# Altium project Dispenser.PrjPCB
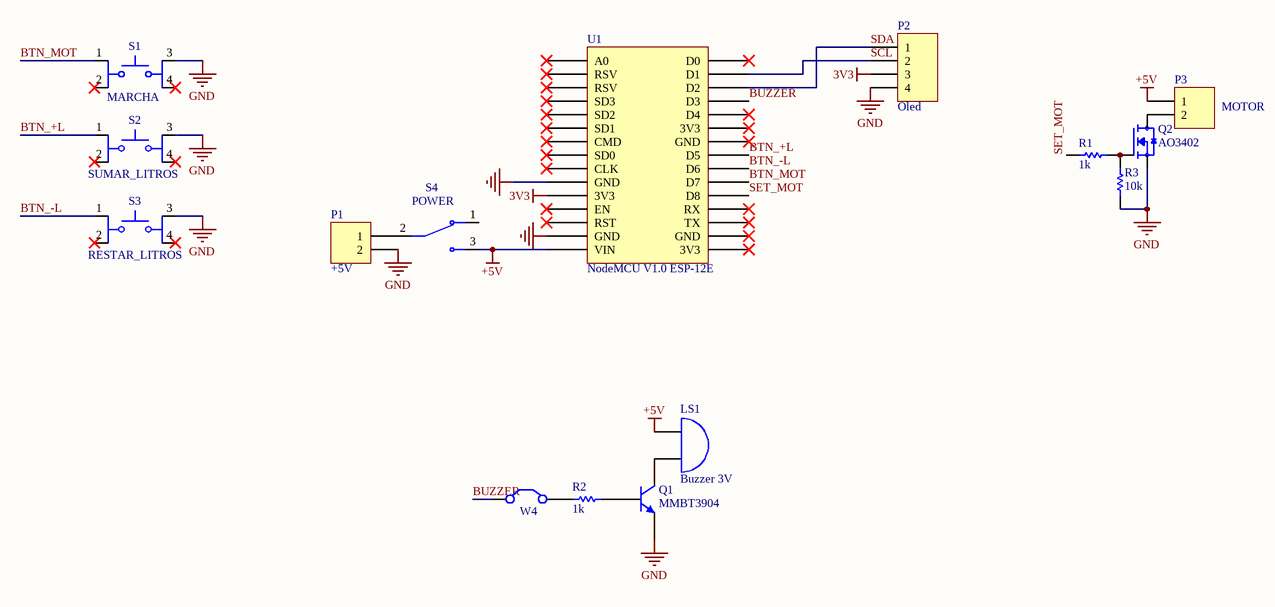
[diagram p0: Dispenser.SchDoc]
1 sheet, 15 parts. Net scope: global (net labels, ports and power ports of the same name join across sheets).
Board file: Dispenser.PcbDoc

## Sheet Dispenser.SchDoc
size A4; CheckedBy: M.Mainenti; DrawnBy: J.M.Navarro; DocumentNumber: 1; Revision: 1.1; SheetNumber: 1; SheetTotal: 1; DrawnDate: 30/05/2023; CheckedDdate: 30/05/2023

### Parts
LS1  Buzzer 3V  [BUZZER]
P1  +5V  [CON1X2]
P2  Oled  [HDR1X4]
P3  MOTOR  [CON1X2]
Q1  MMBT3904  [SOT23_N]
Q2  AO3402  [SOT95P280X125-3N]
R1  1k  [RESC2012N]
R2  1k  [RESC2012N]
R3  10k  [RESC2012N]
S1  MARCHA  [SW_TL3301FF160QG]
S2  SUMAR_LITROS  [SW_TL3301FF160QG]
S3  RESTAR_LITROS  [SW_TL3301FF160QG]
S4  POWER  [SW_MINI-SPDT-SW]
U1  NodeMCU V1.0 ESP-12E  [NodeMCU V1.0 ESP-12E]
W4  Jumper  [RESC1608N]  (value not drawn)

### Nets
3V3: P2.3 U1.3V3
+5V: LS1.1(A) P3.1 S4.3 U1.VIN
GND: P1.2 P2.4 Q1.2(E) Q2.2(S) R3.1 S1.3 S2.3 S3.3 U1.GND
BTN_+L: S2.1 U1.D5
BTN_-L: S3.1 U1.D6
BTN_MOT: S1.1 U1.D7
BUZZER: U1.D3 W4.1(C1)
SCL: P2.2 U1.D1
SDA: P2.1 U1.D2
SET_MOT: R1.1 U1.D8
NetLS1_2: LS1.2(B) Q1.3(C)
NetP1_1: P1.1 S4.2
NetP3_2: P3.2 Q2.3(D)
NetQ1_1: Q1.1(B) R2.2
NetQ2_1: Q2.1(G) R1.2 R3.2
NetR2_1: R2.1 W4.2(C2)

Not connected (* = marked no-connect by the designer): S1 2* 4*; S2 2* 4*; S3 2* 4*; S4 1; U1 A0* CLK* CMD* D0* D4* EN* RST* RSV* RX* SD0* SD1* SD2* SD3* TX*

### Notes on the sheet
- Proyecto
- Pieza N�
- Doc.
- Rev.
- Apr.
- Dib.
- Pag.
- /

### Library data of the parts
LS1 = Bell: Electrical Bell; Published: 24-Mar-1999; LatestRevisionDate: 17-Jul-2002; LatestRevisionNote: Re-released for DXP Platform.; PackageReference: PIN2; Publisher: Altium Limited
P1 P3 = Header 2: Header, 2-Pin; LatestRevisionDate: 17-Jul-2002; LatestRevisionNote: Re-released for DXP Platform.; Publisher: Altium Limited
P2 = Header 4: Header, 4-Pin; LatestRevisionDate: 17-Jul-2002; LatestRevisionNote: Re-released for DXP Platform.; Publisher: Altium Limited
Q1 = MMBT3904: NPN Switching Transistor; Published: 17-Sep-2003; LatestRevisionDate: 12-Dec-2006; LatestRevisionNote: IPC-7351 Footprint Added.; DatasheetVersion: 13-May-2002; PackageVersion: May-1999; PackageReference: SOT23; Publisher: Altium Limited; PackageDescription: 3-Pin SOT-23 Package 0.95 mm Pitch, 2.3 mm Lead Span; ComponentLink1Description: Manufacturer Link; ComponentLink1URL: http://www.semiconductors.philips.com/; ComponentLink2Description: Datasheet; ComponentLink2URL: http://www.semiconductors.philips.com/acrobat/datasheets/MMBT3904_4.pdf
Q2 = AO3402: N-Channel 30V 4A _Ta_ 1.4W _Ta_ Surface Mount SOT-23-3L; MF: Alpha &; Digi-Key_Purchase_URL: https://www.digikey.ca/product-detail/en/alpha-omega-semiconductor-inc/AO3402/785-1002-1-ND/1855944?utm_source=snapeda&utm_medium=aggregator&utm_campaign=symbol; Value: *; MP: AO3402; Package: SOT-23 Alpha &amp; Omega Semiconductor; SnapEDA_Link: https://www.snapeda.com/parts/AO3402/Alpha%20&%20Omega%20Semiconductor%20Inc./view-part/564857/?ref=snap; Digi-Key_Part_Number: 785-1002-1-ND
R1 R2 = Res1: Resistor; Published: 8-Jun-2000; LatestRevisionDate: 17-Jul-2002; LatestRevisionNote: Re-released for DXP Platform.; PackageReference: AXIAL-0.3; Publisher: Altium Limited; PackageDescription: Axial Device, Thru-Hole; 2 Leads; 0.3 in Pin Spacing; Value: 1K
R3 = Res1: Resistor; Value: 1K; Published: 8-Jun-2000; LatestRevisionDate: 17-Jul-2002; LatestRevisionNote: Re-released for DXP Platform.; PackageReference: AXIAL-0.3; Publisher: Altium Limited; PackageDescription: Axial Device, Thru-Hole; 2 Leads; 0.3 in Pin Spacing
S1-S3 = TL3301FF160QG: SWITCH TACTILE SPST-NO 0.05A 12V; MF: E-Switch; Package: None; Check_prices: https://www.snapeda.com/parts/TL3301FF160QG/E-Switch/view-part/?ref=eda; Availability: In Stock; MP: TL3301FF160QG; Value: *; Purchase-URL: https://pricing.snapeda.com/search/part/TL3301FF160QG/?ref=eda; Price: None; SnapEDA_Link: https://www.snapeda.com/parts/TL3301FF160QG/E-Switch/view-part/?ref=snap
S4 = MINI-SPDT-SW: Simple breadboard friendly SPDT slide switch. Rated at 30V/200mA with operating force of 250 +/-100gf.; Availability: Unavailable; Package: None; MP: MINI-SPDT-SW; Value: *; Price: None
U1 = NodeMCU V1.0 ESP-12E: NodeMCU V1.0 ESP8266 (ESP-12E)
W4 = Jumper: Jumper Wire; Published: 24-Mar-1999; LatestRevisionDate: 17-Jul-2002; LatestRevisionNote: Re-released for DXP Platform.; PackageReference: RAD-0.2; Publisher: Altium Limited; PackageDescription: Radial Cap, Thru-Hole; 2 Leads; 0.2 in Pin Spacing